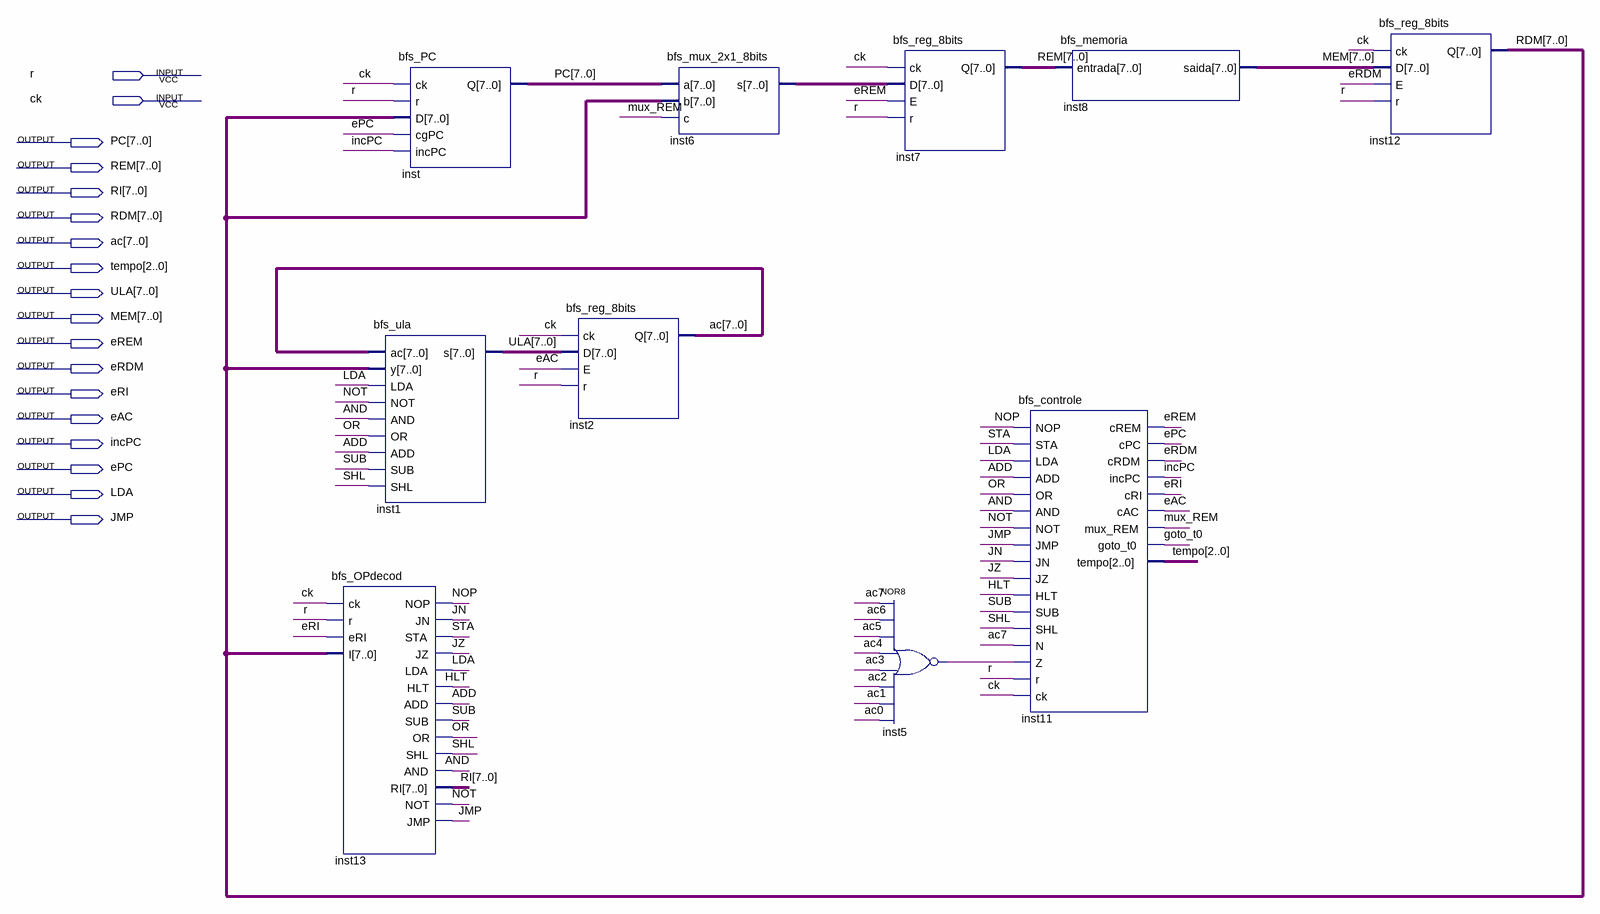
[diagram p0: schematic sheet]
// Quartus schematic bfs_neander.bdf as structural Verilog: 10 symbols, 18 pins
module bfs_neander (
  input  r,
  input  ck,
  output [7:0] PC,
  output [7:0] REM,
  output [7:0] RI,
  output [7:0] RDM,
  output [7:0] ac,
  output [2:0] tempo,
  output [7:0] ULA,
  output [7:0] MEM,
  output eREM,
  output eRDM,
  output eRI,
  output eAC,
  output incPC,
  output ePC,
  output LDA,
  output JMP
);

  wire ADD, AND, goto_t0, HLT, inst5_out, JN, JZ, mux_REM, NOP, NOT, OR, SHL, STA, SUB;
  wire [7:0] inst6_s;

  bfs_OPdecod inst13 (
    .ck(ck), .r(r), .eRI(eRI), .I(RDM), .NOP(NOP), .JN(JN), .STA(STA), .JZ(JZ), .LDA(LDA), .HLT(HLT),
    .ADD(ADD), .SUB(SUB), .OR(OR), .SHL(SHL), .AND(AND), .RI(RI), .NOT(NOT), .JMP(JMP));
  bfs_PC inst (.ck(ck), .r(r), .D(RDM), .cgPC(ePC), .incPC(incPC), .Q(PC));
  bfs_ula inst1 (.ac(ac), .y(RDM), .LDA(LDA), .NOT(NOT), .AND(AND), .OR(OR), .ADD(ADD), .SUB(SUB), .SHL(SHL), .s(ULA));
  bfs_reg_8bits inst2 (.ck(ck), .D(ULA), .E(eAC), .r(r), .Q(ac));
  bfs_mux_2x1_8bits inst6 (.a(PC), .b(RDM), .c(mux_REM), .s(inst6_s));
  nor inst5 (inst5_out, ac[7], ac[6], ac[5], ac[4], ac[3], ac[2], ac[1], ac[0]);
  bfs_reg_8bits inst7 (.ck(ck), .D(inst6_s), .E(eREM), .r(r), .Q(REM));
  bfs_controle inst11 (
    .NOP(NOP), .STA(STA), .LDA(LDA), .ADD(ADD), .OR(OR), .AND(AND), .NOT(NOT), .JMP(JMP), .JN(JN), .JZ(JZ),
    .HLT(HLT), .SUB(SUB), .SHL(SHL), .N(ac[7]), .Z(inst5_out), .r(r), .ck(ck), .cREM(eREM), .cPC(ePC),
    .cRDM(eRDM), .incPC(incPC), .cRI(eRI), .cAC(eAC), .mux_REM(mux_REM), .goto_t0(goto_t0), .tempo(tempo));
  bfs_memoria inst8 (.entrada(REM), .saida(MEM));
  bfs_reg_8bits inst12 (.ck(ck), .D(MEM), .E(eRDM), .r(r), .Q(RDM));
endmodule
